# Altium project PCIEx1toMXM3.0.PrjPcb
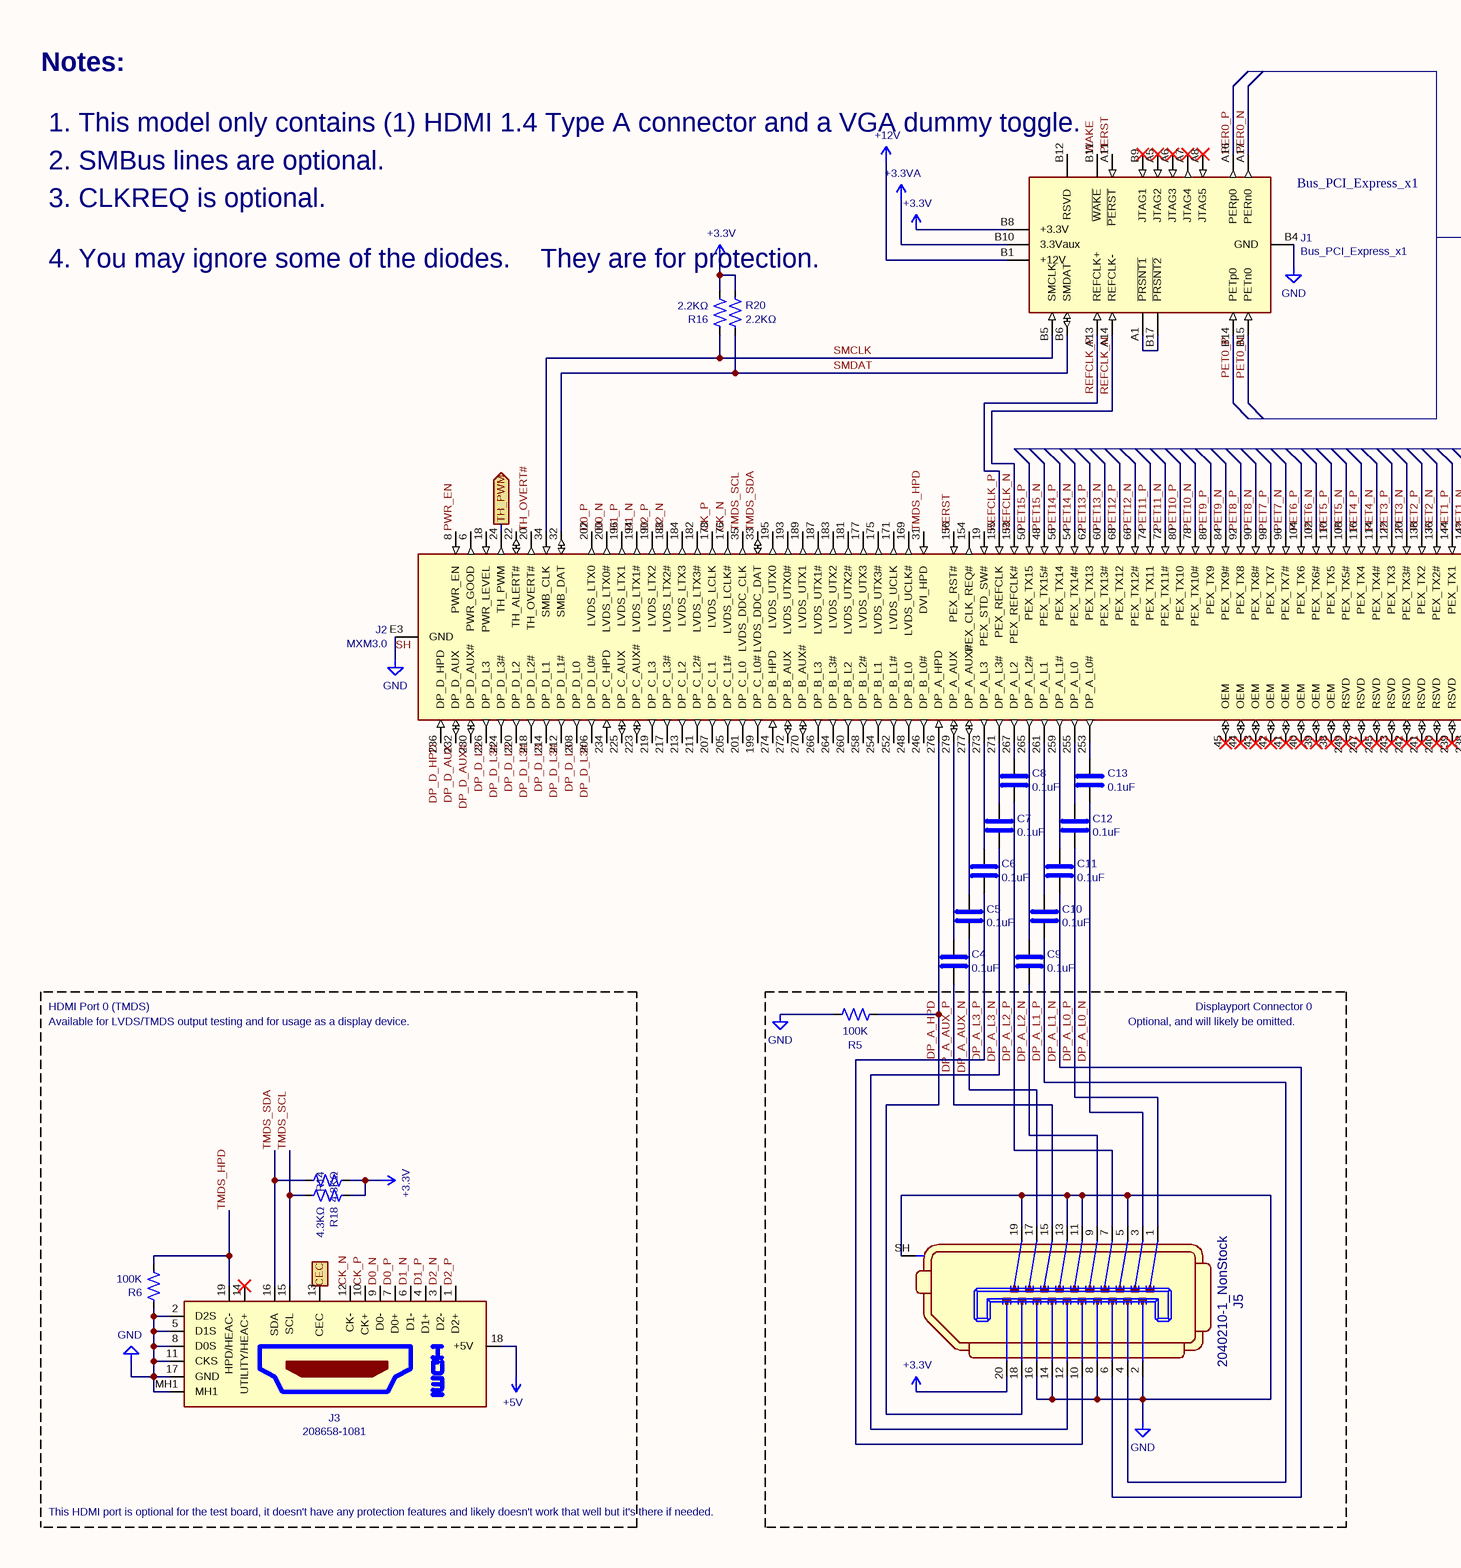
[diagram p0: PCIE x1 MXM 3.1 Riser Basic.SchDoc, left]
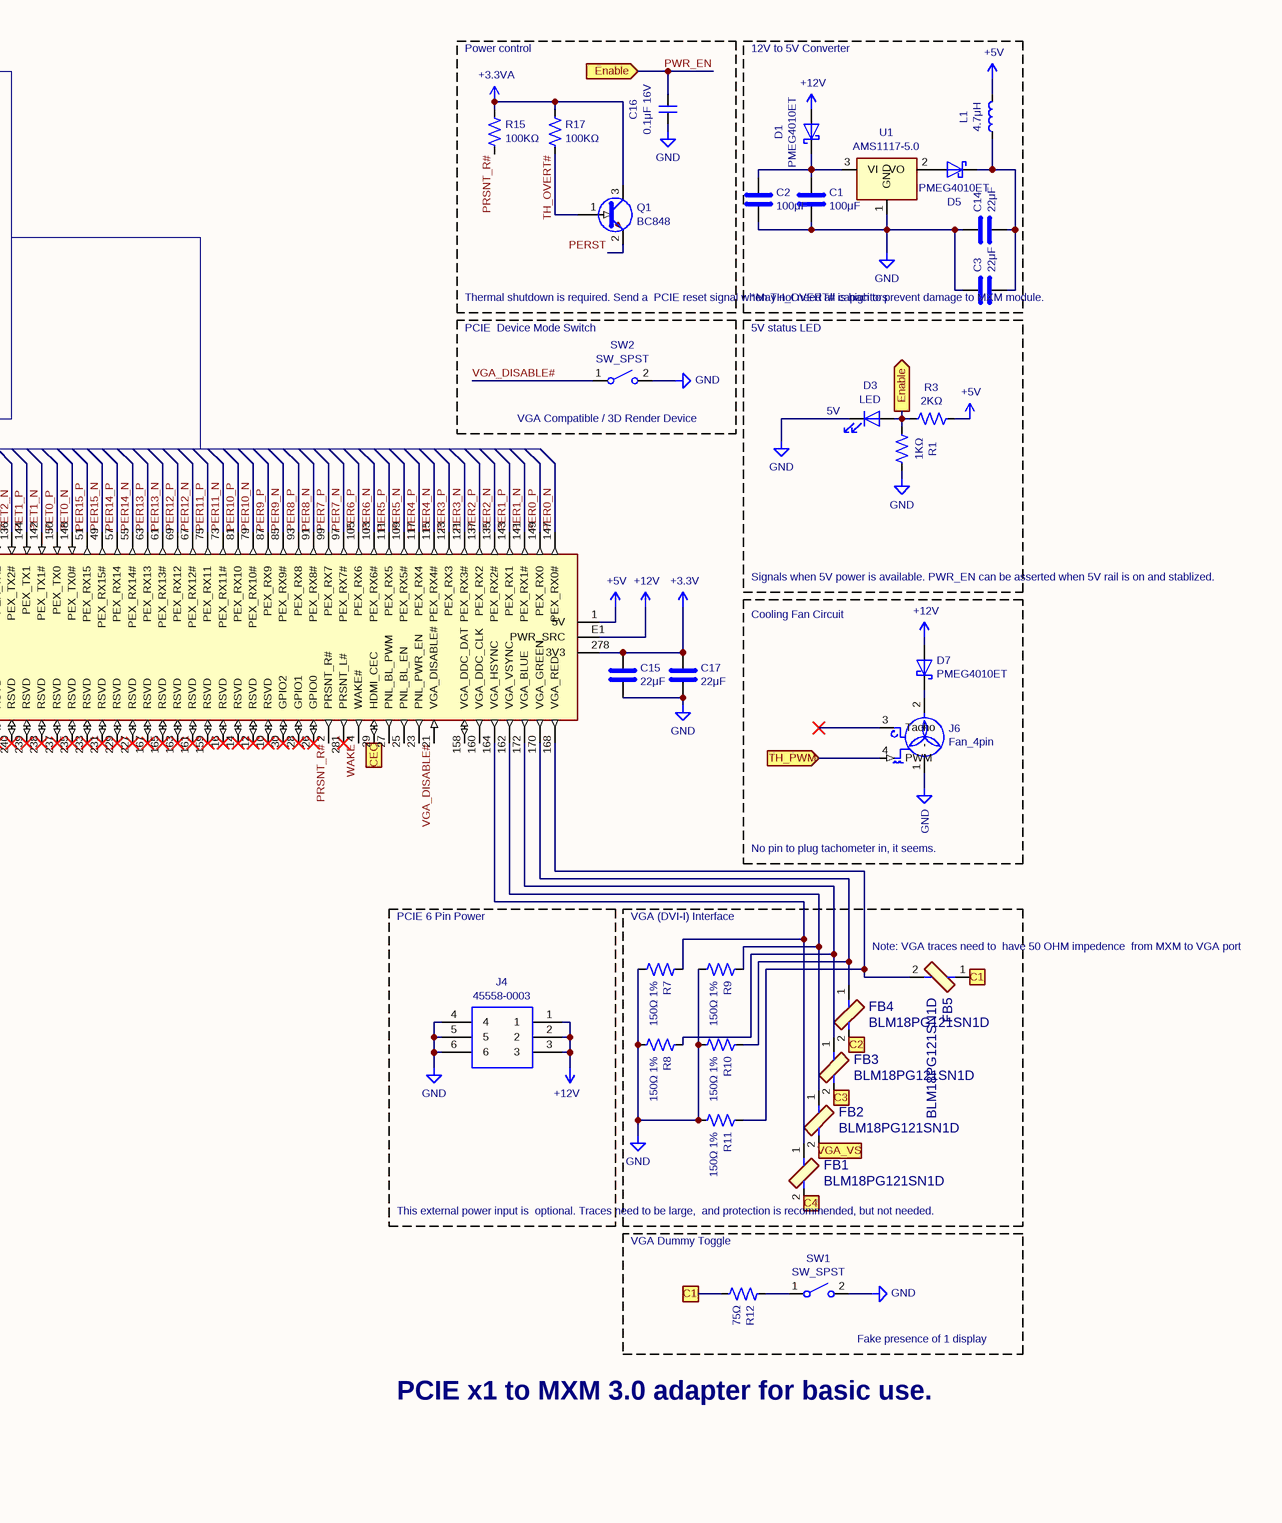
[diagram p1: PCIE x1 MXM 3.1 Riser Basic.SchDoc, right]
1 sheet, 84 parts. Net scope: flat (ports and power ports of the same name join across sheets).
Board files: PCIE x1 MXM 3.1 Riser Basic.PCBDOC, (KiCAD Old) PCIEx1toMXM3.0.PcbDoc

## Sheet PCIE x1 MXM 3.1 Riser Basic.SchDoc
size 431 x 279 mm

### Parts
#PWR01  +12V
#PWR02  +3.3V
#PWR03  GND
#PWR04  GND
#PWR05  +5V
#PWR06  +12V
#PWR07  +3.3V
#PWR08  GND
#PWR09  GND
#PWR010  GND
#PWR011  +5V
#PWR012  +3.3V
#PWR013  +5V
#PWR014  +3.3V
#PWR015  GND
#PWR016  GND
#PWR017  GND
#PWR018  +3.3VA
#PWR019  +3.3VA
#PWR020  GND
#PWR021  GND
#PWR022  +12V
#PWR023  GND
#PWR024  GND
#PWR025  +12V
#PWR026  GND
#PWR028  GND
#PWR029  +3.3V
#PWR0101  GND
#PWR0102  +5V
#PWR0103  +12V
C1  100μF
C2  100μF
C3  22μF
C4  0.1uF
C5  0.1uF
C6  0.1uF
C7  0.1uF
C8  0.1uF
C9  0.1uF
C10  0.1uF
C11  0.1uF
C12  0.1uF
C13  0.1uF
C14  22μF
C15  22μF
C16  0.1μF 16V
C17  22μF
D1  PMEG4010ET  [D_SOT-23_ANK]
D3  LED
D5  PMEG4010ET  [D_SOT-23_ANK]
D7  PMEG4010ET  [D_SOT-23_ANK]
FB1  BLM18PG121SN1D  [0603]
FB2  BLM18PG121SN1D  [0603]
FB3  BLM18PG121SN1D  [0603]
FB4  BLM18PG121SN1D  [0603]
FB5  BLM18PG121SN1D  [0603]
J1  Bus_PCI_Express_x1  [PCIeX1-GF-2D-1000-1K-O36]
J2  MXM3.0  [JAE_MM70-314-310B1-2-R300]
J3  208658-1081  [2086581081]
J4  45558-0003  [455580003]
J5  2040210-1_NonStock  [DisplayPort_2040210-1]
J6  Fan_4pin
L1  4.7μH
Q1  BC848  [SOT-23]
R1  1KΩ
R3  2KΩ
R5  100K
R6  100K
R7  150Ω 1%
R8  150Ω 1%
R9  150Ω 1%
R10  150Ω 1%
R11  150Ω 1%
R12  75Ω
R14  4.3KΩ
R15  100KΩ
R16  2.2KΩ
R17  100KΩ
R18  4.3KΩ
R20  2.2KΩ
SW1  SW_SPST
SW2  SW_SPST
U1  AMS1117-5.0  [SOT-223-3_TabPin2]

### Blocks framed on the sheet
Power control: #PWR010 #PWR019 C16 Q1 R15 R17
PCIE 6 Pin Power: #PWR021 #PWR022 J4
VGA (DVI-I) Interface: #PWR020 FB1-FB5 R7-R11
HDMI Port 0 (TMDS): #PWR012 #PWR013 #PWR017 J3 R6 R14 R18

### Ports
C1, C2, C3, C4, CEC, Enable (in), Enable (out), TH_PWM (in), TH_PWM (out), VGA_VS

### Nets
C1: FB5.1 R12.1 ; port C1
C2: FB4.2 ; port C2
C3: FB3.2 ; port C3
C4: FB1.2 ; port C4
CEC: J2.29(HDMI_CEC) J3.13(CEC) ; port CEC
CK_N: J2.176(LVDS_LCLK#) J3.12(CK-)
CK_P: J2.178(LVDS_LCLK) J3.10(CK+)
D0_N: J2.200(LVDS_LTX0#) J3.9(D0-)
D0_P: J2.202(LVDS_LTX0) J3.7(D0+)
D1_N: J2.194(LVDS_LTX1#) J3.6(D1-)
D1_P: J2.196(LVDS_LTX1) J3.4(D1+)
D2_N: J2.188(LVDS_LTX2#) J3.3(D2-)
D2_P: J2.190(LVDS_LTX2) J3.1(D2+)
DP_A_AUX_N: C5.2 J5.17
DP_A_AUX_P: C4.2 J5.15
DP_A_HPD: J2.276(DP_A_HPD) J5.18 R5.1
DP_A_L0_N: C13.2 J5.3
DP_A_L0_P: C12.2 J5.1
DP_A_L1_N: C11.2 J5.6
DP_A_L1_P: C10.2 J5.4
DP_A_L2_N: C9.2 J5.9
DP_A_L2_P: C8.2 J5.7
DP_A_L3_N: C7.2 J5.12
DP_A_L3_P: C6.2 J5.10
DP_D_AUX: J2.232(DP_D_AUX)
DP_D_AUX#: J2.230(DP_D_AUX#)
DP_D_HPD: J2.236(DP_D_HPD)
DP_D_L3: J2.208(DP_D_L0) J2.214(DP_D_L1) J2.220(DP_D_L2) J2.226(DP_D_L3)
DP_D_L3#: J2.206(DP_D_L0#) J2.212(DP_D_L1#) J2.218(DP_D_L2#) J2.224(DP_D_L3#)
PER0_N: J1.A17(PERn0) J2.147(PEX_RX0#)
PER0_P: J1.A16(PERp0) J2.149(PEX_RX0)
PER1_N: J2.141(PEX_RX1#)
PER1_P: J2.143(PEX_RX1)
PER2_N: J2.135(PEX_RX2#)
PER2_P: J2.137(PEX_RX2)
PER3_N: J2.121(PEX_RX3#)
PER3_P: J2.123(PEX_RX3)
PER4_N: J2.115(PEX_RX4#)
PER4_P: J2.117(PEX_RX4)
PER5_N: J2.109(PEX_RX5#)
PER5_P: J2.111(PEX_RX5)
PER6_N: J2.103(PEX_RX6#)
PER6_P: J2.105(PEX_RX6)
PER7_N: J2.97(PEX_RX7#)
PER7_P: J2.99(PEX_RX7)
PER8_N: J2.91(PEX_RX8#)
PER8_P: J2.93(PEX_RX8)
PER9_N: J2.85(PEX_RX9#)
PER9_P: J2.87(PEX_RX9)
PER10_N: J2.79(PEX_RX10#)
PER10_P: J2.81(PEX_RX10)
PER11_N: J2.73(PEX_RX11#)
PER11_P: J2.75(PEX_RX11)
PER12_N: J2.67(PEX_RX12#)
PER12_P: J2.69(PEX_RX12)
PER13_N: J2.61(PEX_RX13#)
PER13_P: J2.63(PEX_RX13)
PER14_N: J2.55(PEX_RX14#)
PER14_P: J2.57(PEX_RX14)
PER15_N: J2.49(PEX_RX15#)
PER15_P: J2.51(PEX_RX15)
PERST: J1.A11(~{PERST}) J2.156(PEX_RST#) Q1.2(E)
PET0_N: J1.B15(PETn0) J2.148(PEX_TX0#)
PET0_P: J1.B14(PETp0) J2.150(PEX_TX0)
PET1_N: J2.142(PEX_TX1#)
PET1_P: J2.144(PEX_TX1)
PET2_N: J2.136(PEX_TX2#)
PET2_P: J2.138(PEX_TX2)
PET3_N: J2.120(PEX_TX3#)
PET3_P: J2.122(PEX_TX3)
PET4_N: J2.114(PEX_TX4#)
PET4_P: J2.116(PEX_TX4)
PET5_N: J2.108(PEX_TX5#)
PET5_P: J2.110(PEX_TX5)
PET6_N: J2.102(PEX_TX6#)
PET6_P: J2.104(PEX_TX6)
PET7_N: J2.96(PEX_TX7#)
PET7_P: J2.98(PEX_TX7)
PET8_N: J2.90(PEX_TX8#)
PET8_P: J2.92(PEX_TX8)
PET9_N: J2.84(PEX_TX9#)
PET9_P: J2.86(PEX_TX9)
PET10_N: J2.78(PEX_TX10#)
PET10_P: J2.80(PEX_TX10)
PET11_N: J2.72(PEX_TX11#)
PET11_P: J2.74(PEX_TX11)
PET12_N: J2.66(PEX_TX12#)
PET12_P: J2.68(PEX_TX12)
PET13_N: J2.60(PEX_TX13#)
PET13_P: J2.62(PEX_TX13)
PET14_N: J2.54(PEX_TX14#)
PET14_P: J2.56(PEX_TX14)
PET15_N: J2.48(PEX_TX15#)
PET15_P: J2.50(PEX_TX15)
PRSNT_R#: J2.2(PRSNT_R#) R15.1
PWR_EN: C16.1 D3.2(A) J2.8(PWR_EN) R1.2 R3.2 ; port Enable
REFCLK_N: J1.A14(REFCLK-) J2.153(PEX_REFCLK#)
REFCLK_P: J1.A13(REFCLK+) J2.155(PEX_REFCLK)
SH: #PWR04.1(GND) J2.E3(GND)
SMCLK: J1.B5(SMCLK) J2.34(SMB_CLK) R16.2
SMDAT: J1.B6(SMDAT) J2.32(SMB_DAT) R20.1
TH_OVERT#: J2.20(TH_OVERT#) Q1.1(B) R17.1
TH_PWM: J2.24(TH_PWM) J6.4(PWM) ; port TH_PWM
TMDS_HPD: J2.31(DVI_HPD) J3.19(HPD/HEAC-) R6.2
TMDS_SCL: J2.35(LVDS_DDC_CLK) J3.15(SCL) R18.1
TMDS_SDA: J2.33(LVDS_DDC_DAT) J3.16(SDA) R14.2
VGA_DISABLE#: J2.21(VGA_DISABLE#) SW2.1(A)
VGA_VS: FB2.2 ; port VGA_VS
WAKE: J1.B11(~{WAKE}) J2.4(WAKE#)
Net#PWR01_1: #PWR01.1(+12V) J1.B1(+12V)
Net#PWR02_1: #PWR02.1(+3V3) J1.B8(+3.3V)
Net#PWR03_1: #PWR03.1(GND) J1.B4(GND)
Net#PWR05_1: #PWR05.1(+5V) J2.1(5V)
Net#PWR06_1: #PWR06.1(+12V) J2.E1(PWR_SRC)
Net#PWR07_1: #PWR07.1(+3V3) C15.1 C17.1 J2.278(3V3)
Net#PWR08_1: #PWR08.1(GND) D3.1(K)
Net#PWR09_1: #PWR09.1(GND) R1.1
Net#PWR010_1: #PWR010.1(GND) C16.2
Net#PWR011_1: #PWR011.1(+5V) R3.1
Net#PWR012_1: #PWR012.1(+3V3) R14.1 R18.2
Net#PWR013_1: #PWR013.1(+5V) J3.18(+5V)
Net#PWR014_1: #PWR014.1(+3V3) J5.20
Net#PWR015_1: #PWR015.1(GND) J5.2 J5.5 J5.8 J5.11 J5.13 J5.14 J5.16 J5.19 J5.SH
Net#PWR016_1: #PWR016.1(GND) R5.2
Net#PWR017_1: #PWR017.1(GND) J3.2(D2S) J3.5(D1S) J3.8(D0S) J3.11(CKS) J3.17(GND) J3.MH1 R6.1
Net#PWR018_1: #PWR018.1(+3.3VA) J1.B10(3.3Vaux)
Net#PWR019_1: #PWR019.1(+3.3VA) Q1.3(C) R15.2 R17.2
Net#PWR020_1: #PWR020.1(GND) R7.1 R8.1 R9.1 R10.1 R11.1
Net#PWR021_1: #PWR021.1(GND) J4.4 J4.5 J4.6
Net#PWR022_1: #PWR022.1(+12V) J4.1 J4.2 J4.3
Net#PWR023_1: #PWR023.1(GND) SW2.2(B)
Net#PWR024_1: #PWR024.1(GND) SW1.2(B)
Net#PWR025_1: #PWR025.1(+12V) D7.2(A)
Net#PWR026_1: #PWR026.1(GND) J6.1(-)
Net#PWR028_1: #PWR028.1(GND) C15.2 C17.2
Net#PWR029_1: #PWR029.1(+3V3) R16.1 R20.2
Net#PWR0101_1: #PWR0101.1(GND) C1.2 C2.2 C3.1 C14.1 U1.1(GND)
Net#PWR0102_1: #PWR0102.1(+5V) L1.2
Net#PWR0103_1: #PWR0103.1(+12V) D1.2(A)
NetC1_1: C1.1 C2.1 D1.1(K) U1.3(VI)
NetC3_2: C3.2 C14.2 D5.1(K) L1.1
NetC4_1: C4.1 J2.279(DP_A_AUX)
NetC5_1: C5.1 J2.277(DP_A_AUX#)
NetC6_1: C6.1 J2.273(DP_A_L3)
NetC7_1: C7.1 J2.271(DP_A_L3#)
NetC8_1: C8.1 J2.267(DP_A_L2)
NetC9_1: C9.1 J2.265(DP_A_L2#)
NetC10_1: C10.1 J2.261(DP_A_L1)
NetC11_1: C11.1 J2.259(DP_A_L1#)
NetC12_1: C12.1 J2.255(DP_A_L0)
NetC13_1: C13.1 J2.253(DP_A_L0#)
NetD5_2: D5.2(A) U1.2(VO)
NetD7_1: D7.1(K) J6.2(+)
NetFB1_1: FB1.1 J2.164(VGA_HSYNC) R7.2
NetFB2_1: FB2.1 J2.162(VGA_VSYNC) R9.2
NetFB3_1: FB3.1 J2.172(VGA_BLUE) R8.2
NetFB4_1: FB4.1 J2.170(VGA_GREEN) R10.2
NetFB5_2: FB5.2 J2.168(VGA_RED) R11.2
NetJ1_A1: J1.A1(~{PRSNT1}) J1.B17(~{PRSNT2})
NetR12_2: R12.2 SW1.1(A)

Not connected (* = marked no-connect by the designer): J1 A2(+12V) A3(+12V) A4(GND) A5(JTAG2)* A6(JTAG3)* A7(JTAG4)* A8(JTAG5)* A9(+3.3V) A10(+3.3V) A12(GND) A15(GND) A18(GND) B2(+12V) B3(+12V) B7(GND) B9(JTAG1)* B12(RSVD) B13(GND) B16(GND) B18(GND); J2 3(5V) 5(5V) 6(PWR_GOOD) 7(5V) 9(5V) 10(RSVD)* 11(GND) 12(RSVD)* 13(GND) 14(RSVD)* 15(GND) 16(RSVD)* 17(GND) 18(PWR_LEVEL) 19(PEX_STD_SW#) 22(TH_ALERT#) 23(PNL_PWR_EN) 25(PNL_BL_EN) 26(GPIO0)* 27(PNL_BL_PWM) 28(GPIO1)* 30(GPIO2)* 36(GND) 37(GND) 38(OEM)* 39(OEM)* 40(OEM)* 41(OEM)* 42(OEM)* 43(OEM)* 44(OEM)* 45(OEM)* 46(GND) 47(GND) 52(GND) 53(GND) 58(GND) 59(GND) 64(GND) 65(GND) 70(GND) 71(GND) 76(GND) 77(GND) 82(GND) 83(GND) 88(GND) 89(GND) 94(GND) 95(GND) 100(GND) 101(GND) 106(GND) 107(GND) 112(GND) 113(GND) 118(GND) 119(GND) 124(GND) 125(GND) 133(GND) 134(GND) 139(GND) 140(GND) 145(GND) 146(GND) 151(GND) 152(GND) 154(PEX_CLK_REQ#) 157(GND) 158(VGA_DDC_DAT) 159(RSVD)* 160(VGA_DDC_CLK) 161(RSVD)* 163(RSVD)* 165(RSVD)* 166(GND) 167(RSVD)* 169(LVDS_UCLK#) 171(LVDS_UCLK) 173(GND) 174(GND) 175(LVDS_UTX3#) 177(LVDS_UTX3) 179(GND) 180(GND) 181(LVDS_UTX2#) 182(LVDS_LTX3#) 183(LVDS_UTX2) 184(LVDS_LTX3) 185(GND) 186(GND) 187(LVDS_UTX1#) 189(LVDS_UTX1) 191(GND) 192(GND) 193(LVDS_UTX0#) 195(LVDS_UTX0) 197(GND) 198(GND) 199(DP_C_L0#) 201(DP_C_L0) 203(GND) 204(GND) 205(DP_C_L1#) 207(DP_C_L1) 209(GND) 210(GND) 211(DP_C_L2#) 213(DP_C_L2) 215(GND) 216(GND) 217(DP_C_L3#) 219(DP_C_L3) 221(GND) 222(GND) 223(DP_C_AUX#) 225(DP_C_AUX) 227(RSVD)* 228(GND) 229(RSVD)* 231(RSVD)* 233(RSVD)* 234(DP_C_HPD) 235(RSVD)* 237(RSVD)* 238(RSVD)* 239(RSVD)* 240(RSVD)* 241(RSVD)* 242(RSVD)* 243(RSVD)* 244(GND) 245(RSVD)* 246(DP_B_L0#) 247(RSVD)* 248(DP_B_L0) 249(RSVD)* 250(GND) 251(GND) 252(DP_B_L1#) 254(DP_B_L1) 256(GND) 257(GND) 258(DP_B_L2#) 260(DP_B_L2) 262(GND) 263(GND) 264(DP_B_L3#) 266(DP_B_L3) 268(GND) 269(GND) 270(DP_B_AUX#) 272(DP_B_AUX) 274(DP_B_HPD) 275(GND) 280(3V3) 281(PRSNT_L#)* E2(PWR_SRC) E4(GND); J3 14(UTILITY/HEAC+)* MH2 MH3 MH4; J6 3(Tacho)*

### Notes on the sheet
- 12V to 5V Converter
- Notes:
- 1. This model only contains (1) HDMI 1.4 Type A
  connector and a VGA dummy toggle.
- 2. SMBus lines are optional.
- 3. CLKREQ is optional.
- (near #PWR029) 4. You may ignore some of the diodes.
  They are for protection.
- (near C3) Thermal shutdown is required. Send a
  PCIE reset signal when TH_OVERT# is
  high to prevent damage to MXM module.
- (near #PWR0101) *May not need all capacitors
- (near SW2) PCIE  Device Mode Switch
- 5V status LED
- VGA Compatible / 3D Render Device
- (near D3) 5V
- Signals when 5V power is available.
  PWR_EN can be asserted when 5V
  rail is on and stablized.
- Cooling Fan Circuit
- No pin to plug tachometer in, it seems.
- (near FB5) Note: VGA traces need to
  have 50 OHM impedence
  from MXM to VGA port
- Available for LVDS/TMDS output testing and for usage as a display device.
- Optional, and will likely be omitted.
- Displayport Connector 0
- (near FB1) This external power input is
  optional. Traces need to be large,
  and protection is recommended,
  but not needed.
- (near R12) VGA Dummy Toggle
- Fake presence of 1 display
- PCIE x1 to MXM 3.0 adapter for basic use.
- This HDMI port is optional for the test board,
  it doesn't have any protection features and likely
  doesn't work that well but it's there if needed.
- 1
- 2
- 3
- 4
- 5
- 6
- 7
- 8
- A
- B
- C
- D
- E
- Contact me through various online sites
- Title: PCIE x1 to MXM Adapter
- File: PCIEx1toMXM3.0.sch
- Sheet: /
- By Krutav Shah
- KiCad E.D.A.  kicad (5.1.4)-1
- Size: A4
- Date: 2021-02-19
- Rev: 0.1
- Id: 1/1

### Library data of the parts
C1-C15 C17 = C
  C1 C2: Value: 100μF
  C3 C14 C15 C17: Value: 22μF
  C4-C13: Value: 0.1uF
C16 = C_Small: Value: 0.1μF 16V
FB1-FB5 = BLM18PG121SN1D-dk_Ferrite-Beads-and-Chips: Manufacturer: Murata Electronics North America; DK_Detail_Page: /product-detail/en/murata-electronics-north-america/BLM18PG121SN1D/490-1037-1-ND/584485; Digi-Key_PN: 490-1037-1-ND; MPN: BLM18PG121SN1D; Category: Filters; Family: Ferrite Beads and Chips; DK_Datasheet_Link: https://www.murata.com/en-us/products/productdata/8796738650142/ENFA0003.pdf; Status: Active; Value: BLM18PG121SN1D; Footprint: digikey-footprints:0603
J1 = Bus_PCI_Express_x1-Connector1: Value: Bus_PCI_Express_x1; Footprint: Connector_PCBEdge:BUS_PCIexpress_x1
J3 = 208658-1081: Manufacturer_Name: Molex; Height: 6.44; Mouser Part Number: 538-208658-1081; Mouser Price/Stock: https://www.mouser.co.uk/ProductDetail/Molex/208658-1081?qs=wnTfsH77Xs42S8XwiJrhYg%3D%3D; Manufacturer_Part_Number: 208658-1081; Value: 208658-1081
J4 = 45558-0003: Manufacturer_Name: Molex; Height: 10; Mouser Part Number: 538-45558-0003; Mouser Price/Stock: https://www.mouser.co.uk/ProductDetail/Molex/45558-0003?qs=c7kbnNtxOmgPtIF7q2whYA%3D%3D; Manufacturer_Part_Number: 45558-0003; Value: 45558-0003
J5 = 2040210-1_NonStock-dk_USB-DVI-HDMI-Connectors: Manufacturer: TE Connectivity AMP Connectors; DK_Detail_Page: /product-detail/en/te-connectivity-amp-connectors/2040210-1/A99344-ND/1930791; Digi-Key_PN: A99344-ND; MPN: 2040210-1; Category: Connectors, Interconnects; Family: USB, DVI, HDMI Connectors; DK_Datasheet_Link: https://www.te.com/commerce/DocumentDelivery/DDEController?Action=srchrtrv&DocNm=2040210&DocType=Customer+Drawing&DocLang=Japanese; Status: Active NonStock; Value: 2040210-1_NonStock; Footprint: digikey-footprints:DisplayPort_2040210-1
L1 = L: Value: 4.7μH
R1 R3 R5-R12 R14-R18 R20 = R_US
  R1: Value: 1KΩ
  R3: Value: 2KΩ
  R5 R6: Value: 100K
  R7-R11: Value: 150Ω 1%
  R12: Value: 75Ω
  R14 R18: Value: 4.3KΩ
  R15 R17: Value: 100KΩ
  R16 R20: Value: 2.2KΩ
#PWR01 #PWR06 #PWR022 #PWR025 #PWR0103 = +12V: Value: +12V
#PWR02 #PWR07 #PWR012 #PWR014 #PWR029 = +3.3V: Value: +3.3V
#PWR03 #PWR04 #PWR08 #PWR09 #PWR010 #PWR015 #PWR016 #PWR017 #PWR020 #PWR021 #PWR023 #PWR024 #PWR026 #PWR028 #PWR0101 = GND: Value: GND
#PWR05 #PWR011 #PWR013 #PWR0102 = +5V: Value: +5V
#PWR018 #PWR019 = +3.3VA: Value: +3.3VA
D1 D5 D7 = PMEG4010ET: Value: PMEG4010ET; Footprint: Diode_SMD:D_SOT-23_ANK
D3 = LED: Value: LED
J2 = MXM3.0: Value: MXM3.0
J6 = Fan_4pin: Value: Fan_4pin
Q1 = BC848: Value: BC848; Footprint: Package_TO_SOT_SMD:SOT-23
SW1 SW2 = SW_SPST: Value: SW_SPST
U1 = AMS1117-5.0: Value: AMS1117-5.0; Footprint: Package_TO_SOT_SMD:SOT-223-3_TabPin2